# Altium schematic sheet HoverGate-V2-sch.SchDoc
size A2; SheetNumber: 1; SheetTotal: 1
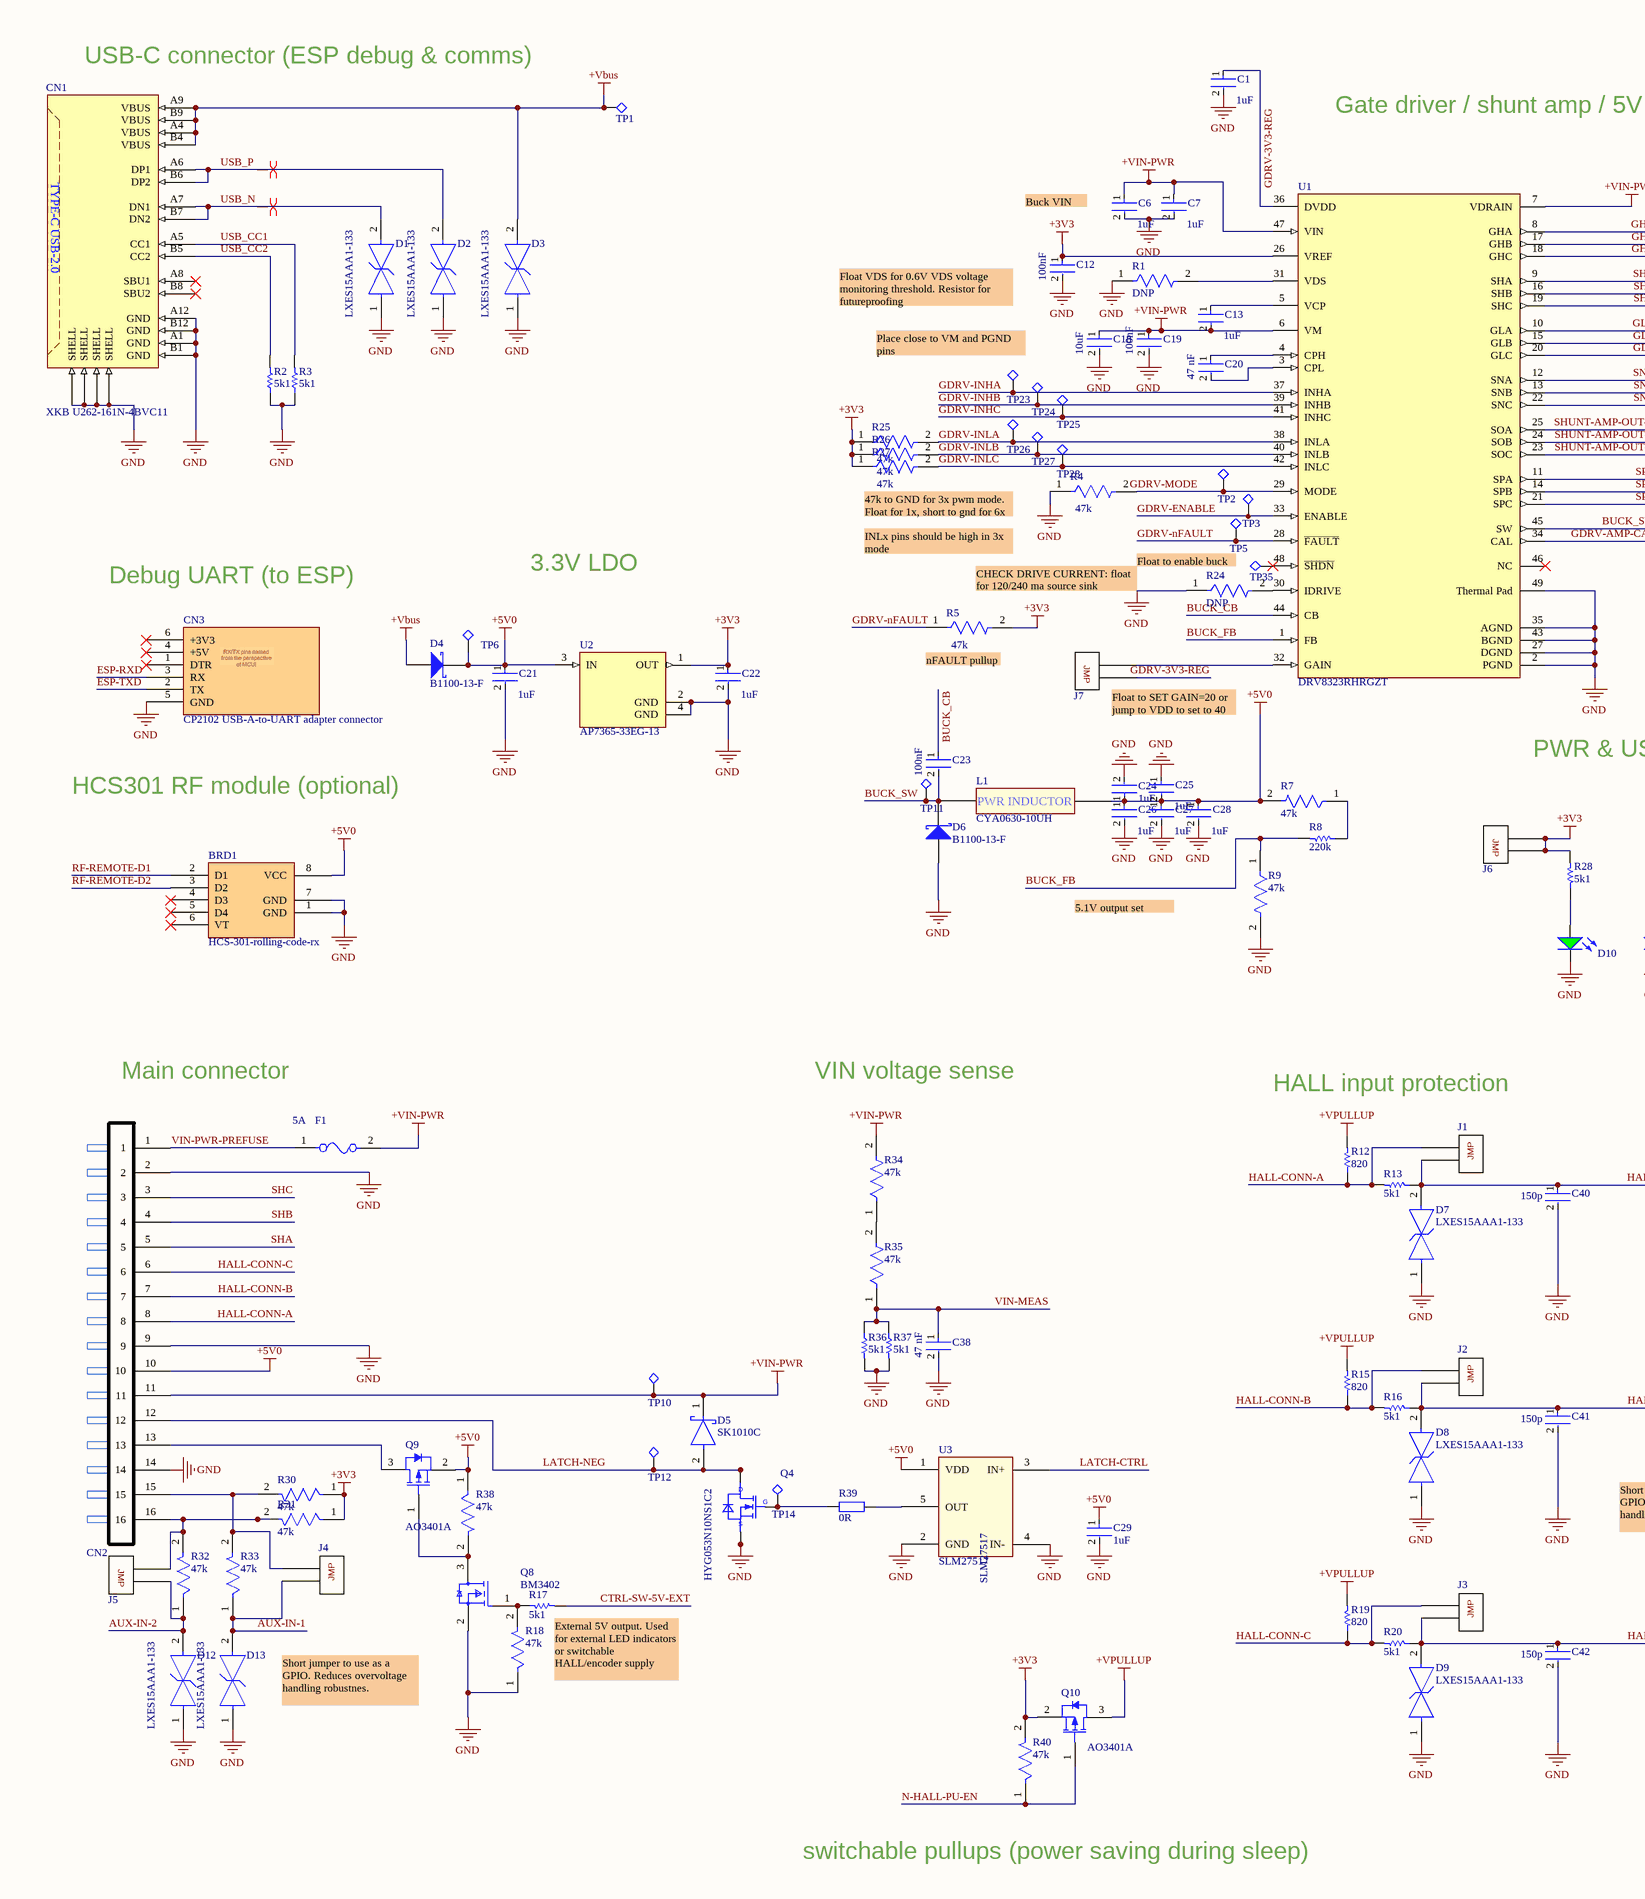
[diagram p0: HoverGate-V2-sch.SchDoc, left]
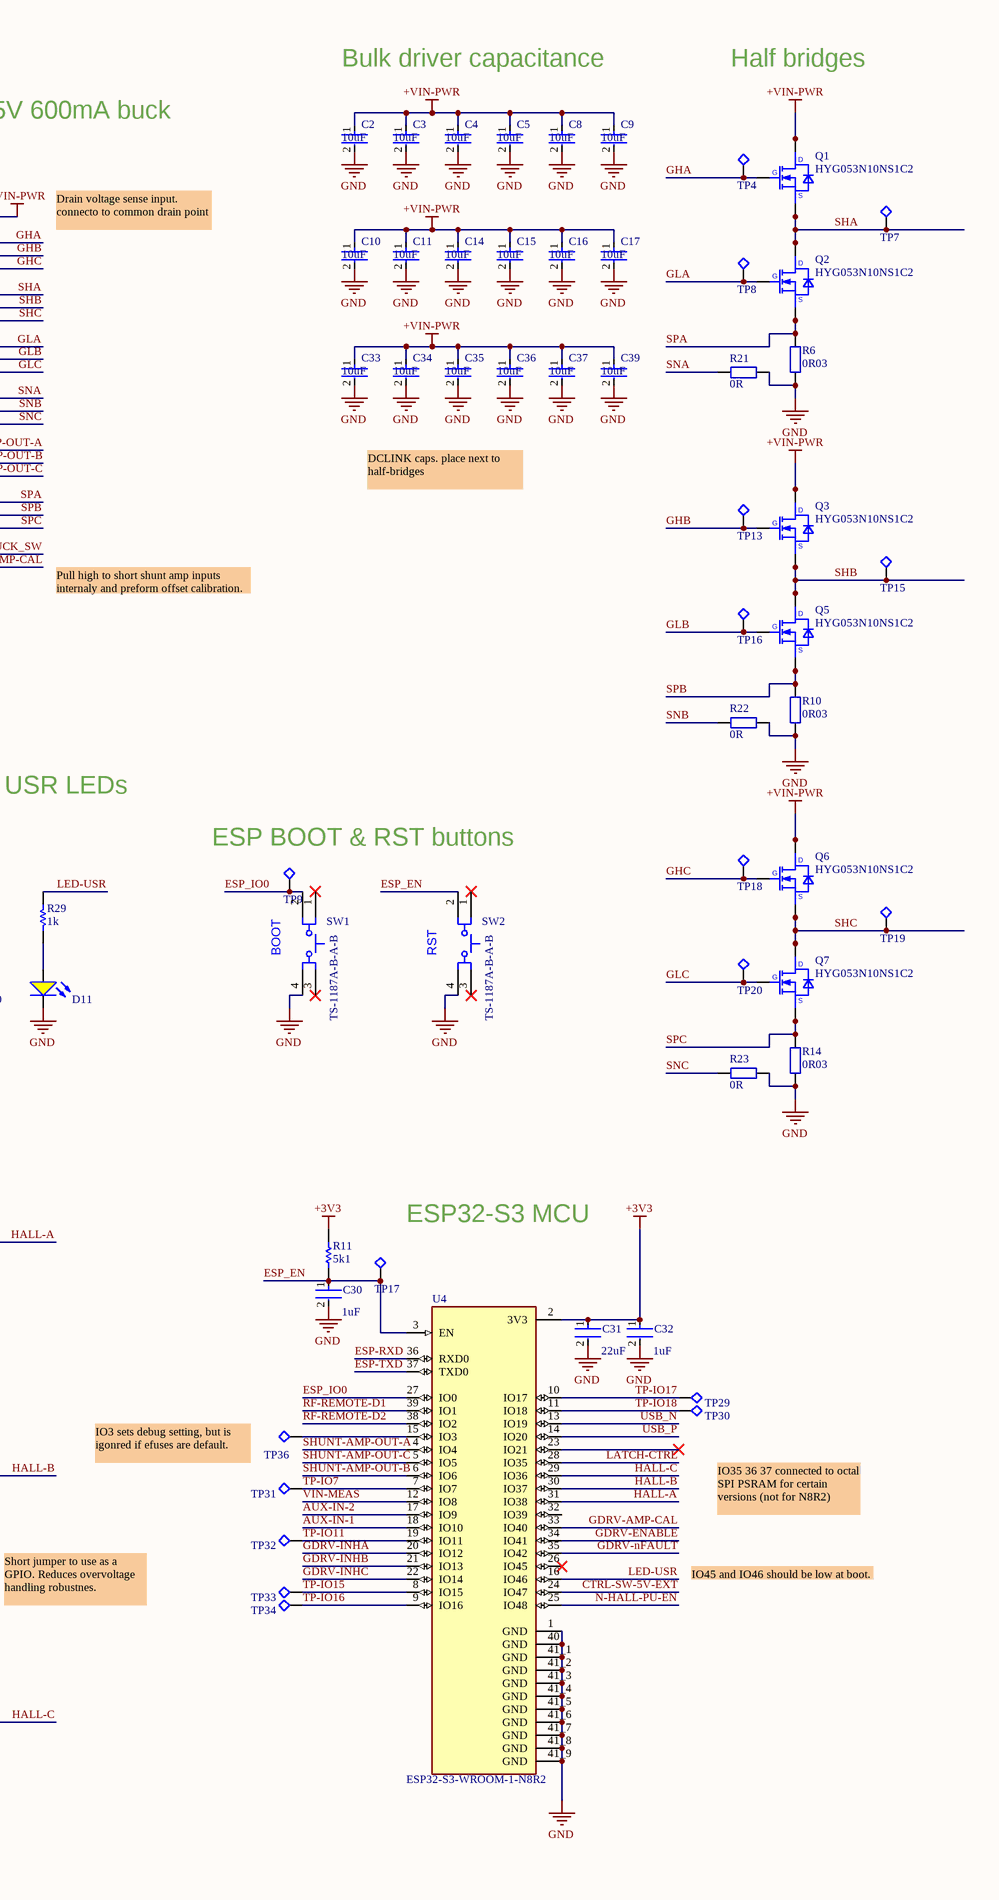
[diagram p1: HoverGate-V2-sch.SchDoc, right]

## Parts
BRD1  HCS-301-rolling-code-rx  [HC301-module]
C1  value 1uF  [FP-CL10B105KO8NNNC-IPC_B]  (hidden comment: CL10A105KB8NNNC)
C2  value 10uF  [FP-CL31-IPC_C]  (hidden comment: CL31A106KBHNNNE)
C3  value 10uF  [FP-CL31-IPC_C]  (hidden comment: CL31A106KBHNNNE)
C4  value 10uF  [FP-CL31-IPC_C]  (hidden comment: CL31A106KBHNNNE)
C5  value 10uF  [FP-CL31-IPC_C]  (hidden comment: CL31A106KBHNNNE)
C6  value 1uF  [FP-CL10B105KO8NNNC-IPC_B]  (hidden comment: CL10A105KB8NNNC)
C7  value 1uF  [FP-CL10B105KO8NNNC-IPC_B]  (hidden comment: CL10A105KB8NNNC)
C8  value 10uF  [FP-CL31-IPC_C]  (hidden comment: CL31A106KBHNNNE)
C9  value 10uF  [FP-CL31-IPC_C]  (hidden comment: CL31A106KBHNNNE)
C10  value 10uF  [FP-CL31-IPC_C]  (hidden comment: CL31A106KBHNNNE)
C11  value 10uF  [FP-CL31-IPC_C]  (hidden comment: CL31A106KBHNNNE)
C12  Capacitance: 100nF  [FP-CL10-IPC_A]  (hidden comment: CL10B104KC8NNNC)
C13  value 1uF  [FP-CL10B105KO8NNNC-IPC_B]  (hidden comment: CL10A105KB8NNNC)
C14  value 10uF  [FP-CL31-IPC_C]  (hidden comment: CL31A106KBHNNNE)
C15  value 10uF  [FP-CL31-IPC_C]  (hidden comment: CL31A106KBHNNNE)
C16  value 10uF  [FP-CL31-IPC_C]  (hidden comment: CL31A106KBHNNNE)
C17  value 10uF  [FP-CL31-IPC_C]  (hidden comment: CL31A106KBHNNNE)
C18  Capacitance: 10uF  [FP-GRM32E-0_2-0_3-MFG]  (hidden comment: GRM32ER71J106KA12L)
C19  Capacitance: 100nF  [FP-CL10-IPC_A]  (hidden comment: CL10B104KC8NNNC)
C20  value 47 nF  [FP-AC0603-IPC_B]  (hidden comment: AC0603KRX7R0BB473)
C21  value 1uF  [FP-CL10B105KO8NNNC-IPC_B]  (hidden comment: CL10A105KB8NNNC)
C22  value 1uF  [FP-CL10B105KO8NNNC-IPC_B]  (hidden comment: CL10A105KB8NNNC)
C23  Capacitance: 100nF  [FP-CL10-IPC_A]  (hidden comment: CL10B104KC8NNNC)
C24  value 1uF  [FP-CL10B105KO8NNNC-IPC_B]  (hidden comment: CL10A105KB8NNNC)
C25  value 1uF  [FP-CL10B105KO8NNNC-IPC_B]  (hidden comment: CL10A105KB8NNNC)
C26  value 1uF  [FP-CL10B105KO8NNNC-IPC_B]  (hidden comment: CL10A105KB8NNNC)
C27  value 1uF  [FP-CL10B105KO8NNNC-IPC_B]  (hidden comment: CL10A105KB8NNNC)
C28  value 1uF  [FP-CL10B105KO8NNNC-IPC_B]  (hidden comment: CL10A105KB8NNNC)
C29  value 1uF  [FP-CL10B105KO8NNNC-IPC_B]  (hidden comment: CL10A105KB8NNNC)
C30  value 1uF  [FP-CL10B105KO8NNNC-IPC_B]  (hidden comment: CL10A105KB8NNNC)
C31  Capacitance: 22uF  [FP-CL31-IPC_B]  (hidden comment: CL31A226KPHNNNE)
C32  value 1uF  [FP-CL10B105KO8NNNC-IPC_B]  (hidden comment: CL10A105KB8NNNC)
C33  value 10uF  [FP-CL31-IPC_C]  (hidden comment: CL31A106KBHNNNE)
C34  value 10uF  [FP-CL31-IPC_C]  (hidden comment: CL31A106KBHNNNE)
C35  value 10uF  [FP-CL31-IPC_C]  (hidden comment: CL31A106KBHNNNE)
C36  value 10uF  [FP-CL31-IPC_C]  (hidden comment: CL31A106KBHNNNE)
C37  value 10uF  [FP-CL31-IPC_C]  (hidden comment: CL31A106KBHNNNE)
C38  value 47 nF  [FP-AC0603-IPC_B]  (hidden comment: AC0603KRX7R0BB473)
C39  value 10uF  [FP-CL31-IPC_C]  (hidden comment: CL31A106KBHNNNE)
C40  value 150p  [FP-AC0603-IPC_B]  (hidden comment: 0603B151K500NT)
C41  value 150p  [FP-AC0603-IPC_B]  (hidden comment: 0603B151K500NT)
C42  value 150p  [FP-AC0603-IPC_B]  (hidden comment: 0603B151K500NT)
CN1  XKB U262-161N-4BVC11  [XKB U262-161N-4BVC11]
CN2  MAX MX15EDGVM-3.81-16P-GN01-Cu-A  [MAX MX15EDGVM-3.81-16P-GN01-Cu-A]  (value not drawn)
CN3  CP2102 USB-A-to-UART adapter connector  [CP2102 USB-A-to-UART adapter connector]
D1  LXES15AAA1-133  [FP-LXES15-IPC_A]
D2  LXES15AAA1-133  [FP-LXES15-IPC_A]
D3  LXES15AAA1-133  [FP-LXES15-IPC_A]
D4  B1100-13-F  [DIOD-SMA-2_V]
D5  SK1010C  [FP-SMC-MFG]
D6  B1100-13-F  [DIOD-SMA-2_V]
D7  LXES15AAA1-133  [FP-LXES15-IPC_A]
D8  LXES15AAA1-133  [FP-LXES15-IPC_A]
D9  LXES15AAA1-133  [FP-LXES15-IPC_A]
D10  KT-0805G  [LED_0805]  (value not drawn)
D11  KT-0805Y  [LED_0805]  (value not drawn)
D12  LXES15AAA1-133  [FP-LXES15-IPC_A]
D13  LXES15AAA1-133  [FP-LXES15-IPC_A]
F1  Fuse Current: 5A  [FP-0469-IPC_B]  (hidden comment: 0458005.DR)
J1  SolderJumperV2  [AislerRule_SolderJumper_1mm]  (value not drawn)
J2  SolderJumperV2  [AislerRule_SolderJumper_1mm]  (value not drawn)
J3  SolderJumperV2  [AislerRule_SolderJumper_1mm]  (value not drawn)
J4  SolderJumperV2  [AislerRule_SolderJumper_1mm]  (value not drawn)
J5  SolderJumperV2  [AislerRule_SolderJumper_1mm]  (value not drawn)
J6  SolderJumperV2  [AislerRule_SolderJumper_1mm]  (value not drawn)
J7  SolderJumperV2  [AislerRule_SolderJumper_1mm]  (value not drawn)
L1  CYA0630-10UH  [CYA0630-10UH]
Q1  HYG053N10NS1C2  [PDFN5*6-8L]
Q2  HYG053N10NS1C2  [PDFN5*6-8L]
Q3  HYG053N10NS1C2  [PDFN5*6-8L]
Q4  HYG053N10NS1C2  [PDFN5*6-8L]
Q5  HYG053N10NS1C2  [PDFN5*6-8L]
Q6  HYG053N10NS1C2  [PDFN5*6-8L]
Q7  HYG053N10NS1C2  [PDFN5*6-8L]
Q8  BM3402  [FP-SOT23-IPC_B]
Q9  AO3401A  [AO-SOT-23-3L_V]
Q10  AO3401A  [AO-SOT-23-3L_V]
R1  DNP  [FP-RC0603FR-0747KL-MFG]
R2  value 5k1  [RESC1608X55X30NL15T15]  (hidden comment: 0603WAF5101T5E)
R3  value 5k1  [RESC1608X55X30NL15T15]  (hidden comment: 0603WAF5101T5E)
R4  Resistance: 47k  [FP-RC0603FR-0747KL-MFG]  (hidden comment: RC0603FR-0747KL)
R5  Resistance: 47k  [FP-RC0603FR-0747KL-MFG]  (hidden comment: RC0603FR-0747KL)
R6  value 0R03  [FPR_CRF2512_R0]  (hidden comment: LR2512D-3W-3mR-1%)
R7  Resistance: 47k  [FP-RC0603FR-0747KL-MFG]  (hidden comment: RC0603FR-0747KL)
R8  value 220k  [RESC1608X55X30NL15T15]  (hidden comment: 0603WAF2203T5E)
R9  Resistance: 47k  [FP-RC0603FR-0747KL-MFG]  (hidden comment: RC0603FR-0747KL)
R10  value 0R03  [FPR_CRF2512_R0]  (hidden comment: LR2512D-3W-3mR-1%)
R11  value 5k1  [RESC1608X55X30NL15T15]  (hidden comment: 0603WAF5101T5E)
R12  value 820  [RESC1608X55X30NL15T15]  (hidden comment: 0603WAF8200T5E)
R13  value 5k1  [RESC1608X55X30NL15T15]  (hidden comment: 0603WAF5101T5E)
R14  value 0R03  [FPR_CRF2512_R0]  (hidden comment: LR2512D-3W-3mR-1%)
R15  value 820  [RESC1608X55X30NL15T15]  (hidden comment: 0603WAF8200T5E)
R16  value 5k1  [RESC1608X55X30NL15T15]  (hidden comment: 0603WAF5101T5E)
R17  value 5k1  [RESC1608X55X30NL15T15]  (hidden comment: 0603WAF5101T5E)
R18  Resistance: 47k  [FP-RC0603FR-0747KL-MFG]  (hidden comment: RC0603FR-0747KL)
R19  value 820  [RESC1608X55X30NL15T15]  (hidden comment: 0603WAF8200T5E)
R20  value 5k1  [RESC1608X55X30NL15T15]  (hidden comment: 0603WAF5101T5E)
R21  value 0R  [FPR_0603_R_R0]  (hidden comment: 0603WAF0000T5E)
R22  value 0R  [FPR_0603_R_R0]  (hidden comment: 0603WAF0000T5E)
R23  value 0R  [FPR_0603_R_R0]  (hidden comment: 0603WAF0000T5E)
R24  DNP  [FP-RC0603FR-0747KL-MFG]
R25  Resistance: 47k  [FP-RC0603FR-0747KL-MFG]  (hidden comment: RC0603FR-0747KL)
R26  Resistance: 47k  [FP-RC0603FR-0747KL-MFG]  (hidden comment: RC0603FR-0747KL)
R27  Resistance: 47k  [FP-RC0603FR-0747KL-MFG]  (hidden comment: RC0603FR-0747KL)
R28  value 5k1  [RESC1608X55X30NL15T15]  (hidden comment: 0603WAF5101T5E)
R29  value 1k  [RESC1608X55X30NL15T15]  (hidden comment: 0603WAF1001T5E)
R30  Resistance: 47k  [FP-RC0603FR-0747KL-MFG]  (hidden comment: RC0603FR-0747KL)
R31  Resistance: 47k  [FP-RC0603FR-0747KL-MFG]  (hidden comment: RC0603FR-0747KL)
R32  Resistance: 47k  [FP-RC0603FR-0747KL-MFG]  (hidden comment: RC0603FR-0747KL)
R33  Resistance: 47k  [FP-RC0603FR-0747KL-MFG]  (hidden comment: RC0603FR-0747KL)
R34  Resistance: 47k  [FP-RC0603FR-0747KL-MFG]  (hidden comment: RC0603FR-0747KL)
R35  Resistance: 47k  [FP-RC0603FR-0747KL-MFG]  (hidden comment: RC0603FR-0747KL)
R36  value 5k1  [RESC1608X55X30NL15T15]  (hidden comment: 0603WAF5101T5E)
R37  value 5k1  [RESC1608X55X30NL15T15]  (hidden comment: 0603WAF5101T5E)
R38  Resistance: 47k  [FP-RC0603FR-0747KL-MFG]  (hidden comment: RC0603FR-0747KL)
R39  value 0R  [FPR_0603_R_R0]  (hidden comment: 0603WAF0000T5E)
R40  Resistance: 47k  [FP-RC0603FR-0747KL-MFG]  (hidden comment: RC0603FR-0747KL)
SW1  TS-1187A-B-A-B  [ESWI-TL3342F160QG_V]
SW2  TS-1187A-B-A-B  [ESWI-TL3342F160QG_V]
TP1  test point 1.5mm  [TP1_FULL]  (value not drawn)
TP2  test point 1.5mm  [TP1_FULL]  (value not drawn)
TP3  test point 1.5mm  [TP1_FULL]  (value not drawn)
TP4  test point 1.5mm  [TP1_FULL]  (value not drawn)
TP5  test point 1.5mm  [TP1_FULL]  (value not drawn)
TP6  test point 1.5mm  [TP1_FULL]  (value not drawn)
TP7  test point 1.5mm  [TP1_FULL]  (value not drawn)
TP8  test point 1.5mm  [TP1_FULL]  (value not drawn)
TP9  test point 1.5mm  [TP1_FULL]  (value not drawn)
TP10  test point 1.5mm  [TP1_FULL]  (value not drawn)
TP11  test point 1.5mm  [TP1_FULL]  (value not drawn)
TP12  test point 1.5mm  [TP1_FULL]  (value not drawn)
TP13  test point 1.5mm  [TP1_FULL]  (value not drawn)
TP14  test point 1.5mm  [TP1_FULL]  (value not drawn)
TP15  test point 1.5mm  [TP1_FULL]  (value not drawn)
TP16  test point 1.5mm  [TP1_FULL]  (value not drawn)
TP17  test point 1.5mm  [TP1_FULL]  (value not drawn)
TP18  test point 1.5mm  [TP1_FULL]  (value not drawn)
TP19  test point 1.5mm  [TP1_FULL]  (value not drawn)
TP20  test point 1.5mm  [TP1_FULL]  (value not drawn)
TP23  test point 1.5mm  [TP1_FULL]  (value not drawn)
TP24  test point 1.5mm  [TP1_FULL]  (value not drawn)
TP25  test point 1.5mm  [TP1_FULL]  (value not drawn)
TP26  test point 1.5mm  [TP1_FULL]  (value not drawn)
TP27  test point 1.5mm  [TP1_FULL]  (value not drawn)
TP28  test point 1.5mm  [TP1_FULL]  (value not drawn)
TP29  test point 1.5mm  [TP1_FULL]  (value not drawn)
TP30  test point 1.5mm  [TP1_FULL]  (value not drawn)
TP31  test point 1.5mm  [TP1_FULL]  (value not drawn)
TP32  test point 1.5mm  [TP1_FULL]  (value not drawn)
TP33  test point 1.5mm  [TP1_FULL]  (value not drawn)
TP34  test point 1.5mm  [TP1_FULL]  (value not drawn)
TP35  test point 1.5mm  [TP1_FULL]  (value not drawn)
TP36  test point 1.5mm  [TP1_FULL]  (value not drawn)
U1  DRV8323RHRGZT  [FP-RGZ0048A-IPC_A]
U2  AP7365-33EG-13  [FP-SOT223-IPC_C]
U3  SLM27517  [Diodes Inc SOT25]
U4  ESP32-S3-WROOM-1-N8R2  [XCVR_ESP32-S3-WROOM-1-N8R2]

## Nets
+3V3: C12.1 C22.1 C31.1 C32.1 J6.1(P1) J6.2 Q10.2(SOURCE) R5.2 R11.2 R25.1 R26.1 R27.1 R28.2 R30.1 R31.1 R40.2 U1.26(VREF) U2.1(OUT) U4.2(3V3)
+5V0: BRD1.8(VCC) C21.1 C24.1 C25.2 C26.1 C27.1 C28.1 C29.1 CN2.10 D4.2(K) L1.2 Q9.2(SOURCE) R7.2 R38.1 TP6.1 U2.3(IN) U3.1(VDD)
+Vbus: CN1.A4(VBUS) CN1.A9(VBUS) CN1.B4(VBUS) CN1.B9(VBUS) D3.2 D4.1(A) TP1.1
+VIN-PWR: C2.1 C3.1 C4.1 C5.1 C6.1 C7.1 C8.1 C9.1 C10.1 C11.1 C13.2 C14.1 C15.1 C16.1 C17.1 C18.1 C19.1 C33.1 C34.1 C35.1 C36.1 C37.1 C39.1 CN2.11 D5.1(C) F1.2 Q1.5(DRAIN) Q1.6(DRAIN) Q1.7(DRAIN) Q1.8(DRAIN) Q1.9(DRAIN) Q3.5(DRAIN) Q3.6(DRAIN) Q3.7(DRAIN) Q3.8(DRAIN) Q3.9(DRAIN) Q6.5(DRAIN) Q6.6(DRAIN) Q6.7(DRAIN) Q6.8(DRAIN) Q6.9(DRAIN) R34.2 TP10.1 U1.6(VM) U1.7(VDRAIN) U1.47(VIN)
+VPULLUP: Q10.3(DRAIN) R12.2 R15.2 R19.2
GND: BRD1.1(GND) BRD1.7(GND) C1.2 C2.2 C3.2 C4.2 C5.2 C6.2 C7.2 C8.2 C9.2 C10.2 C11.2 C12.2 C14.2 C15.2 C16.2 C17.2 C18.2 C19.2 C21.2 C22.2 C24.2 C25.1 C26.2 C27.2 C28.2 C29.2 C30.2 C31.2 C32.2 C33.2 C34.2 C35.2 C36.2 C37.2 C38.2 C39.2 C40.2 C41.2 C42.2 CN1.A1(GND) CN1.A12(GND) CN1.B1(GND) CN1.B12(GND) CN1.SHELL1(SHELL) CN1.SHELL2(SHELL) CN1.SHELL3(SHELL) CN1.SHELL4(SHELL) CN2.2 CN2.9 CN2.14 CN3.5(GND) D1.1 D2.1 D3.1 D6.1(A) D7.1 D8.1 D9.1 D10.1(-) D11.1(-) D12.1 D13.1 Q4.1(SOURCE) Q4.2(SOURCE) Q4.3(SOURCE) Q8.2(S) R1.1 R2.1 R3.1 R4.1 R6.1 R9.2 R10.1 R14.1 R18.1 R21.1 R22.1 R23.1 R24.1 R36.2 R37.2 SW1.4 SW2.4 U1.2(PGND) U1.27(DGND) U1.35(AGND) U1.43(BGND) U1.49(Thermal_Pad) U2.2(GND) U2.4(GND) U3.2(GND) U3.4(IN-) U4.1(GND) U4.40(GND) U4.41_1(GND) U4.41_2(GND) U4.41_3(GND) U4.41_4(GND) U4.41_5(GND) U4.41_6(GND) U4.41_7(GND) U4.41_8(GND) U4.41_9(GND)
AUX-IN-1: D13.2 J4.2 R33.1 U4.18(IO10)
AUX-IN-2: D12.2 J5.1(P1) R32.1 U4.17(IO9)
BUCK_CB: C23.1 U1.44(CB)
BUCK_FB: R8.2 R9.1 U1.1(FB)
BUCK_SW: C23.2 D6.2(K) L1.1 TP11.1 U1.45(SW)
CTRL-SW-5V-EXT: R17.2 U4.24(IO47)
ESP-RXD: CN3.3(RX) U4.36(RXD0)
ESP-TXD: CN3.2(TX) U4.37(TXD0)
ESP_EN: C30.1 R11.1 SW2.2 TP17.1 U4.3(EN)
ESP_IO0: SW1.2 TP9.1 U4.27(IO0)
GDRV-3V3-REG: C1.1 J7.1(P1) U1.36(DVDD)
GDRV-AMP-CAL: U1.34(CAL) U4.33(IO40)
GDRV-ENABLE: TP3.1 U1.33(ENABLE) U4.34(IO41)
GDRV-INHA: TP23.1 U1.37(INHA) U4.20(IO12)
GDRV-INHB: TP24.1 U1.39(INHB) U4.21(IO13)
GDRV-INHC: TP25.1 U1.41(INHC) U4.22(IO14)
GDRV-INLA: R25.2 TP26.1 U1.38(INLA)
GDRV-INLB: R26.2 TP27.1 U1.40(INLB)
GDRV-INLC: R27.2 TP28.1 U1.42(INLC)
GDRV-MODE: R4.2 TP2.1 U1.29(MODE)
GDRV-nFAULT: R5.1 TP5.1 U1.28(~{FAULT}) U4.35(IO42)
GHA: Q1.4(GATE) TP4.1 U1.8(GHA)
GHB: Q3.4(GATE) TP13.1 U1.17(GHB)
GHC: Q6.4(GATE) TP18.1 U1.18(GHC)
GLA: Q2.4(GATE) TP8.1 U1.10(GLA)
GLB: Q5.4(GATE) TP16.1 U1.15(GLB)
GLC: Q7.4(GATE) TP20.1 U1.20(GLC)
HALL-A: C40.1 D7.2 J1.2 R13.1 U4.31(IO38)
HALL-B: C41.1 D8.2 J2.2 R16.1 U4.30(IO37)
HALL-C: C42.1 D9.2 J3.2 R20.1 U4.29(IO36)
HALL-CONN-A: CN2.8 J1.1(P1) R12.1 R13.2
HALL-CONN-B: CN2.7 J2.1(P1) R15.1 R16.2
HALL-CONN-C: CN2.6 J3.1(P1) R19.1 R20.2
LATCH-CTRL: U3.3(IN+) U4.28(IO35)
LATCH-NEG: CN2.12 D5.2(A) Q4.5(DRAIN) Q4.6(DRAIN) Q4.7(DRAIN) Q4.8(DRAIN) Q4.9(DRAIN) TP12.1
LED-USR: R29.2 U4.16(IO46)
N-HALL-PU-EN: Q10.1(GATE) R40.1 U4.25(IO48)
RF-REMOTE-D1: BRD1.2(D1) U4.39(IO1)
RF-REMOTE-D2: BRD1.3(D2) U4.38(IO2)
SHA: CN2.5 Q1.1(SOURCE) Q1.2(SOURCE) Q1.3(SOURCE) Q2.5(DRAIN) Q2.6(DRAIN) Q2.7(DRAIN) Q2.8(DRAIN) Q2.9(DRAIN) TP7.1 U1.9(SHA)
SHB: CN2.4 Q3.1(SOURCE) Q3.2(SOURCE) Q3.3(SOURCE) Q5.5(DRAIN) Q5.6(DRAIN) Q5.7(DRAIN) Q5.8(DRAIN) Q5.9(DRAIN) TP15.1 U1.16(SHB)
SHC: CN2.3 Q6.1(SOURCE) Q6.2(SOURCE) Q6.3(SOURCE) Q7.5(DRAIN) Q7.6(DRAIN) Q7.7(DRAIN) Q7.8(DRAIN) Q7.9(DRAIN) TP19.1 U1.19(SHC)
SHUNT-AMP-OUT-A: U1.25(SOA) U4.4(IO4)
SHUNT-AMP-OUT-B: U1.24(SOB) U4.6(IO6)
SHUNT-AMP-OUT-C: U1.23(SOC) U4.5(IO5)
SNA: R21.2 U1.12(SNA)
SNB: R22.2 U1.13(SNB)
SNC: R23.2 U1.22(SNC)
SPA: Q2.1(SOURCE) Q2.2(SOURCE) Q2.3(SOURCE) R6.2 U1.11(SPA)
SPB: Q5.1(SOURCE) Q5.2(SOURCE) Q5.3(SOURCE) R10.2 U1.14(SPB)
SPC: Q7.1(SOURCE) Q7.2(SOURCE) Q7.3(SOURCE) R14.2 U1.21(SPC)
TP-IO7: TP31.1 U4.7(IO7)
TP-IO11: TP32.1 U4.19(IO11)
TP-IO15: TP33.1 U4.8(IO15)
TP-IO16: TP34.1 U4.9(IO16)
TP-IO17: TP29.1 U4.10(IO17)
TP-IO18: TP30.1 U4.11(IO18)
USB_CC1: CN1.A5(CC1) R3.2
USB_CC2: CN1.B5(CC2) R2.2
USB_N: CN1.A7(DN1) CN1.B7(DN2) D1.2 U4.13(IO19)
USB_P: CN1.A6(DP1) CN1.B6(DP2) D2.2 U4.14(IO20)
VIN-MEAS: C38.1 R35.1 R36.1 R37.1 U4.12(IO8)
VIN-PWR-PREFUSE: CN2.1 F1.1
NetC13_1: C13.1 U1.5(VCP)
NetC20_1: C20.1 U1.4(CPH)
NetC20_2: C20.2 U1.3(CPL)
NetCN2_13: CN2.13 Q9.3(DRAIN)
NetCN2_15: CN2.15 J4.1(P1) R30.2 R33.2
NetCN2_16: CN2.16 J5.2 R31.2 R32.2
NetD10_2: D10.2(+) R28.1
NetD11_2: D11.2(+) R29.1
NetJ7_2: J7.2 U1.32(GAIN)
NetQ4_4: Q4.4(GATE) R39.2 TP14.1
NetQ8_1: Q8.1(G) R17.1 R18.2
NetQ8_3: Q8.3(D) Q9.1(GATE) R38.2
NetR1_2: R1.2 U1.31(VDS)
NetR7_1: R7.1 R8.1
NetR24_2: R24.2 U1.30(IDRIVE)
NetR34_1: R34.1 R35.2
NetR39_1: R39.1 U3.5(OUT)
NetTP35_1: TP35.1 U1.48(~{SHDN})
NetTP36_1: TP36.1 U4.15(IO3)

Not connected (* = marked no-connect by the designer): BRD1 4(D3)* 5(D4)* 6(VT)*; CN1 A8(SBU1)* B8(SBU2)*; CN3 1(DTR)* 4(+5V)* 6(+3V3)*; SW1 1* 3*; SW2 1* 3*; U1 46(NC)*; U4 23(IO21)* 26(IO45)* 32(IO39)

## Layout directives
differential pair: USB_N, USB_P

## Notes on the sheet
- (near CN1) USB-C connector (ESP debug & comms)
- Bulk driver capacitance
- Half bridges
- Gate driver / shunt amp / 5V 600mA buck
- Buck VIN
- Drain voltage sense input. connecto to common drain point
- Float VDS for 0.6V VDS voltage monitoring threshold. Resistor for futureproofing
- Place close to VM and PGND pins
- DCLINK caps. place next to half-bridges
- 47k to GND for 3x pwm mode. Float for 1x, short to gnd for 6x
- Debug UART (to ESP)
- 3.3V LDO
- INLx pins should be high in 3x mode
- (near R5) CHECK DRIVE CURRENT: float for 120/240 ma source sink
- Float to enable buck
- Pull high to short shunt amp inputs internaly and preform offset calibration.
- (near R5) nFAULT pullup
- (near J7) Float to SET GAIN=20 or jump to VDD to set to 40
- PWR & USR LEDs
- HCS301 RF module (optional)
- (near TP9) ESP BOOT & RST buttons
- 5.1V output set
- (near SW1) BOOT
- (near SW2) RST
- Main connector
- VIN voltage sense
- HALL input protection
- (near TP17) ESP32-S3 MCU
- IO3 sets debug setting, but is igonred if efuses are default.
- IO35 36 37 connected to octal SPI PSRAM for certain versions (not for N8R2)
- Short jumper to use as a GPIO. Reduces overvoltage handling robustnes.
- IO45 and IO46 should be low at boot.
- (near R17) External 5V output. Used for external LED indicators or switchable HALL/encoder supply
- switchable pullups (power saving during sleep)
- (in symbol CP2102 USB-A-to-UART adapter connector) RX/TX pins named from the perspective of MCU!
- (in symbol HYG053N10NS1C2) D; G; S
- (in symbol PowerInductor) PWR INDUCTOR
- (in symbol SolderJumperV2) JMP
- (in symbol XKB U262-161N-4BVC11) TYPE-C USB-2.0

## Library data of the parts
C1 C6 C7 C13 C21 C22 C24-C30 C32 = CMP-2000-06093-2: CAP CER 1UF 50V X5R 0603; Manufacturer: Samsung Electro-Mechanics America, Inc; Manufacturer Part Number: CL10B105KO8NNNC; Temperature Coefficient: 15%; Material: Ceramic; Tolerance: 10%; Voltage Rating: 50V; Automotive: No; ComponentLink2Description: Datasheet; Device Class L3: Ceramic Capacitors; Capacitance: 1uF; Temperature Characteristic: X5R; Temperature Range High: +125°C; Digikey Description: CAP CER 1UF 16V X7R 0603; Device Class L2: Capacitors; Octopart: https://octopart.com/cl10b105ko8nnnc-samsung-19018973; ComponentLink2URL: http://www.samsungsem.com/global/front/downloadcms.do?path=%2F%2Fglobal%2F%2Fsupport%2F%2Fproduct-search%2F%2Fmlcc%2F%2F__icsFiles%2F%2Fafieldfile%2F%2F2019%2F%2F06%2F%2F18&fileName=CL10B105KO8NNNC-19.pdf; Lead Free: Yes; Height: 0.9mm; Package: CL10B105KO8NNNC; Temperature Range Low: -55°C; Device Class L1: Passive Components; RoHS: TRUE; Temperature: -55°C to +125°C; Category: Cap; Ipc Land Pattern Name: CAPC16080X80; LCSC: C15849
C2-C5 C8-C11 C14-C17 C33-C37 C39 = CMP-13271-000016-1: CAP CER 10UF 50V X5R 1206; Manufacturer: Samsung; Tolerance: 10%; Material: Ceramic; Temperature Coefficient: 15%; RoHS: TRUE; Ipc Land Pattern Name: CAPC320160X160; Temperature Range Low: -55°C; Device Class L3: Ceramic Capacitors; Category: Cap; Temperature Characteristic: X5R; Lead Free: Yes; Device Class L2: Capacitors; Octopart: https://octopart.com/cl31a106kbhnnne-samsung-19832778; ComponentLink2Description: Datasheet; Digikey Description: CAP CER 10UF 50V X5R 1206; Voltage: 50V; ComponentLink2URL: http://www.samsungsem.com/kr/support/product-search/mlcc/__icsFiles/afieldfile/2018/06/21/CL31A106KBHNNNE.pdf; Capacitance: 10uF; Manufacturer Part Number: CL31A106KBHNNNE; Temperature Range High: +85°C; Device Class L1: Passive Components; Height: 1.8mm; Automotive: No; Voltage Rating: 50V; Package: CL31; Temperature: -55°C to +85°C; LCSC: C13585
C12 C19 C23 = CMP-13271-004036-1: Cap Ceramic 100nF 100V X7R ±10% Pad SMD 0603 +125°C T/R; Mount: Surface Mount; Packaging: Cut Tape; Width: 0.031inch; Thickness: 0.035inch; Length: 0.063inch; Tolerance: 10%; Min Operating Temperature: -55°C; Case/Package: 0603; Voltage Rating: 100V; Max Operating Temperature: 125°C; Case Code (Metric): 1608; Case Code (Imperial): 0603
C18 = CMP-2000-07458-2: CAP CER 10UF 63V X7R 1210; Material: Ceramic; Tolerance: 10%; Package Quantity: 1000; Weight: 0.00388oz; Voltage Rating (DC): 63V; Packaging: Tape and Reel; Length: 3.2mm; Width: 2.5mm; REACH SVHC: No SVHC; Max Operating Temperature: 125°C; Dielectric Material: Ceramic; Thickness: 0.106inch; Mount: Surface Mount; Case Code (Metric): 3225; Depth: 2.5mm; Voltage Rating: 63V; RoHS Compliant: Yes; Lead Free: Lead Free; Dielectric: X7R; Case Code (Imperial): 1210; Min Operating Temperature: -55°C; Height: 2.5mm; Case/Package: 1210; Voltage: 63V; Termination: SMD/SMT; LCSC: C437568
C20 C38 = CMP-03422-001184-1: CAP CER 0.047UF 100V X7R 0603; Manufacturer: Yageo; Automotive Grade: Grade 1; Tolerance: 0.1; Temperature Coefficient: 15%; Material: Ceramic; Temperature Characteristic: X7R; Automotive: Yes; Package: AC0603; ComponentLink2Description: Datasheet; Height: 0.9mm; Octopart: https://octopart.com/ac0603krx7r0bb473-yageo-87214085; Capacitance: 47 nF; Device Class L2: Capacitors; Temperature: -55°C to +125°C; Ipc Land Pattern Name: CAPC16080X80; Device Class L3: Ceramic Capacitors; Temperature Range Low: -55°C; Temperature Range High: +125°C; Category: Cap; ComponentLink2URL: http://www.yageo.com/documents/recent/UPY-AC_NP0X7R_16V-to-630V_12.pdf; Digikey Description: CAP CER 0.047UF 100V X7R 0603; Manufacturer Part Number: AC0603KRX7R0BB473; Device Class L1: Passive Components; RoHS: TRUE; Voltage Rating: 100 V; Mouser Description: AC Series 0603 47 nF 100 V ±10% X7R Auto Multilayer Ceramic Chip Capacitor; Lead Free: Yes; Footprint Url: http://www.yageo.com/exep/pages/download/literatures/UPY-C_GEN_24.pdf; LCSC: C469624
C31 = CMP-13271-002604-1: Cap Ceramic 22uF 10V X5R ±10% SMD 1206; Package Quantity: 1; Radiation Hardening: No; Thickness: 0.071inch; Case Code (Metric): 3216; Height: 1.6mm; Min Operating Temperature: -55°C; Width: 0.063inch; Mount: Surface Mount; Packaging: Tape and Reel; Depth: 1.6mm; Max Operating Temperature: 85°C; Dielectric: X5R; Case/Package: 1206; Lead Free: Lead Free; Tolerance: 10%; Case Code (Imperial): 1206; Length: 3.2mm; Voltage Rating (DC): 10V; Voltage Rating: 10V; LCSC: C5672
C40-C42 = CMP-03422-001184-1: CAP CER 150p 50V X7R 0603; LCSC: C1594
  C41 C42: ComponentLink2Description: Datasheet; ComponentLink2URL: http://www.yageo.com/documents/recent/UPY-AC_NP0X7R_16V-to-630V_12.pdf
CN1 = XKB U262-161N-4BVC11: USB Type-C connector, USB-2.0, 16 pins; LCSC: C319148
CN2 = MAX MX15EDGVM-3.81-16P-GN01-Cu-A: Board connector for 16 pin pluggable screw terminal; LCSC: C5188240
D1-D3 D7-D9 D12 D13 = CMP-06195-000011-1: TVS DIODE 15V 1005; Number of Bidirectional Channels: 1; Power Line Protection: No; Mount: Surface Mount; Case Code (Metric): 1005; Min Operating Temperature: -40°C; Case Code (Imperial): 0402; Resistor Type: Zener; Reverse Standoff Voltage: 15V; Case/Package: 0402; Packaging: Tape and Reel; Max Operating Temperature: 85°C; LCSC: C191267
D4 D6 = CMP-2000-05882-1: Schottky Barrier Rectifier, 100 V, 1 A, -65 to 150 degC, 2-Pin SMA, RoHS, Tape and Reel; Manufacturer: DiodesIncorporated; Unit Weight: 0.002258oz; Vf - Forward Voltage: 0.79V; Configuration: Single; Vrrm - Repetitive Reverse Voltage: 100V; Ifsm - Forward Surge Current: 30A; Ir - Reverse Current: 500uA; If - Forward Current: 1A; Height: 2.1mm; Packaging: Reel; Package Reference: SMA-2; Product Category: SchottkyDiodes&Rectifiers; Manufacturer URL: http://www.diodes.com/; Type: SchottkyBarrierRectifier; Minimum Operating Temperature: -65C; Mounting Technology: SurfaceMount; Length: 4.6mm; Datasheet URL: http://www.diodes.com/_files/datasheets/ds30018.pdf; Width: 2.92mm; Brand: DiodesIncorporated; Maximum Operating Temperature: +150C; RoHS: True; Package Description: 2-Pin Surface Mounted Assembly, Body 4.3 x 2.605 mm, Height 2.4 mm; Operating Temperature Range: -65Cto+150C; Series: B1100; Mounting Style: SMD/SMT; Product: SchottkyDiodes; Package / Case: SMA; Technology: Si; Termination Style: SMD/SMT; Datasheet Version: 01/2016; Factory Pack Quantity: 5000; LCSC: C110106
D5 = CMP-2000-05097-3: DIODE SCHOTTKY 100V 10A SMC; Manufacturer Part Number: B540C-13-F; Manufacturer: Diodes Inc.; Reverse Voltage: 40V; Automotive Grade: NA; Peak Reverse Current: 0.5mA; Value: 300pF; Max Junction Temp: +150°C; Forward Current: 5A; Max Surge Forward Current: 100A; Standoff Height: 0.1mm; Digikey Description: DIODE SCHOTTKY 40V 5A SMC; Temperature Range Low: -55°C; Octopart: https://octopart.com/b540c-13-f-diodes+inc.-325873; Lead Free: Yes; RoHS: TRUE; Category: Diode; Mouser Description: Diode: Schottky rectifying; SMD; 40V; 5A; SMC; Package: reel, tape; ComponentLink2Description: Datasheet; Temperature Range High: +150°C; Automotive: No; Footprint Url: https://www.diodes.com/assets/Package-Files/SMC.pdf; Device Class L3: Schottky Diodes; Height: 2.5mm; Temperature: -55°C to +150°C; Package: SMC; ComponentLink2URL: https://www.diodes.com/assets/Datasheets/ds13012.pdf; Device Class L2: Diodes; Max Repetitive Reverse Voltage: 40V; Device Class L1: Discrete Semiconductors; Capacitance: 300pF; LCSC: C3018527
D10 = LED Green: KT-0805G LED Green; LCSC: C2297
D11 = LED Blue: LED Yellow KT-0805Y; LCSC: C2296
F1 = CMP-08605-000100-1: FUSE BOARD MOUNT 5A 75VDC 1206; Approvals: UL; Voltage Rating (DC): 32V; Blow Characteristic: TIME DELAY; DC Cold Resistance: 35mR; Power Dissipation: 1.08W; Fuse Type: Board Mount (Cartridge Style Excluded); Body Material: Ceramic; Max Operating Temperature: 150°C; Depth: 1.63mm; Radiation Hardening: No; Height: 0.9mm; Number of Pins: 2; Resistor Type: Ceramic; Terminal Material: Nickel; Case/Package: 1206; Resistance: 35mR; RoHS Compliant: Yes; Lead Free: Lead Free; Housing Material: Ceramic; Packaging: Tape and Reel; Width: 1.63mm; Mount: Surface Mount; Min Operating Temperature: -55°C; Working Voltage: 32V; Series: 469; Package Quantity: 3000; Termination: SMD/SMT; Size: 0.9mm; Case Code (Imperial): 1206; Current Rating: 5A; Case Code (Metric): 3216; Voltage Rating: 32V; Length: 3.27mm; LCSC: C187561
L1 = PowerInductor: SMD Power inductio, 10uH 4A; ComponentLink1Description: Datasheet; ComponentLink1URL: *; LCSC: C5189958
Q1-Q7 = HYG053N10NS1C2: 100V 95A 4.6mOhm N-channel mosfet
Q8 = CMP-83955-000006-1: BORN BM3402 MOSFET N-CH 30V 5.1A SOT23; LCSC: C431498
Q9 Q10 = CMP-2000-05778-1: P-Channel MOSFET, 30 V, 4 A, -55 to 150 degC, 3-Pin SOT-23-3L, RoHS, Tape and Reel; Manufacturer: Alpha and Omega; Output Power (Max): NotRequiredW; Power Dissipation: 1.4W; Rad Hardened: No; Drain Efficiency: NotRequired%; Drain-Source On-Volt: 30V; Noise Figure: NotRequireddB; Frequency (Max): NotRequiredMHz; Number of  Elements: 1; Gate-Source Voltage (Max): ?12V; Drain Current (Max): 4A; Channel Mode: Enhancement; Drain-Source On-Res: 0.044ohm; Type: PowerMOSFET; Polarity: P; Package URL: http://www.aosmd.com/res/packaging_information/SOT-23-3L.pdf; Datasheet URL: http://www.aosmd.com/res/data_sheets/AO3401A.pdf; Package Type: SOT-23; Package Description: 3-Pin Small Outline Transistor, Body 2.95 x 1.6 mm, Pitch 0.95 mm; Mounting: SurfaceMount; Manufacturer URL: http://www.aosmd.com/; Continuous Drain Current: 4A; Package Reference: SOT-23-3L; Mounting Technology: SurfaceMount; Operating Temperature Classification: Military; Power Gain: NotRequireddB; Datasheet Version: Rev. 3, 03/2011; Operating Temp Range: -55Cto150C; Pin Count: 3
R1 R4 R5 R7 R9 R18 R24-R27 R30-R35 R38 R40 = CMP-1659-00055-2: RES SMD 47K OHM 1% 1/10W 0603; Voltage Rating: 50V; Temperature Coefficient: 100ppm/°C; Max Power Dissipation: 100mW; Voltage Rating (DC): 50V; Min Operating Temperature: -55°C; Packaging: Tape and Reel; Features: Moisture Resistant; Termination: SMD/SMT; Technology: THICK FILM; Lead Free: Lead Free; Max Operating Temperature: 155°C; Width: 0.031inch; Case Code (Metric): 1608; Tolerance: 1%; Package Quantity: 1; Resistor Type: Thick Film; RoHS Compliant: Yes; Case/Package: 0603; Case Code (Imperial): 0603; Resistance Tolerance: 1%; Length: 0.063inch; Series: RC; Number of Pins: 2; Power Rating: 100mW; Number of Terminations: 2; Construction: Rectangular; Height: 0.022inch; Military Standard: Not; Size Code: 0603; Depth: 0.8mm; LCSC: C105579
  R1 R24: Resistance: 47k
R2 R3 R11-R13 R15-R17 R19 R20 R28 R29 R36 R37 = CMP-2000-00540-1: Manufacturer: UNI_ROYAL
  R2 R3 R11 R13 R16 R17 R20 R28 R36 R37: Part Number: 0603WAF5101T5E; LCSC: C23186
  R12 R15 R19: Part Number: 0603WAF8200T5E; LCSC: C23253
  R29: Part Number: 0603WAF1001T5E; LCSC: C21190
R6 R10 R14 = R: 2512 3mohm shunt; LCSC: C500737
R8 = CMP-2000-00540-1: Part Number: 0603WAF5101T5E; Manufacturer: UNI_ROYAL; LCSC: C22961
R21-R23 R39 = R: 0R resistor
SW1 SW2 = CMP-1696-00003-1: XKB TS-1187A-B-A-B C318884; LCSC: C318884
TP1-TP20 TP23-TP36 = Test Point: Test point ,1.5mm diameter, no hole; Category: testpoints
U1 = CMP-04912-000089-1: IC MTR DRV MULTIPHAS 6-60V 48QFN; Output Current: 5mA; Max Operating Temperature: 125°C; Packaging: Cut Tape; Min Operating Temperature: -40°C; Case/Package: VQFN; RoHS Compliant: Yes; Mount: Surface Mount
U2 = CMP-12756-000040-1: IC REG LIN 3.3V 600MA SOT223-3; Max Input Voltage: 6V; Min Current Limit: 800mA; Polarity: Positive; Accuracy: 2%; Number of Outputs: 1; Quiescent Current: 80uA; Output Type: Fixed; Dropout Voltage: 300mV; Min Input Voltage: 2V; Package Quantity: 2500; Output Voltage: 3.3V; Number of Pins: 4; Packaging: Tape and Reel; Min Operating Temperature: -40°C; Mount: Surface Mount; Output Current: 600mA; Max Output Current: 600mA; Max Operating Temperature: 85°C; Case/Package: SOT-223-3; Radiation Hardening: No; REACH SVHC: No SVHC; Number of Regulators: 1; Weight: 0.000282oz
U3 = SLM27517: mosfet gate driver
U4 = ESP32-S3-WROOM-1-N8R2: WiFi 802.11a/b/g/n, Bluetooth v5.0 Transceiver Module 2.4GHz Antenna Not Included -; MF: Espressif Systems; Package: - Espressif Systems; Price: None; Check_prices: https://www.snapeda.com/parts/ESP32-S3-WROOM-1-N8R2/Espressif+Systems/view-part/?ref=eda; Value: *; SnapEDA_Link: https://www.snapeda.com/parts/ESP32-S3-WROOM-1-N8R2/Espressif+Systems/view-part/?ref=snap; MP: ESP32-S3-WROOM-1-N8R2; Availability: In Stock; Purchase-URL: https://pricing.snapeda.com/search?q=ESP32-S3-WROOM-1-N8R2&ref=eda